# Altium schematic sheet top.SchDoc: top schematic
size 420 x 297 mm; Date: 2021-12-08; Author: Joachim Löfwander; Revision: AAA-000; SheetNumber: 1; SheetTotal: 4; Website: github.com/jlofw
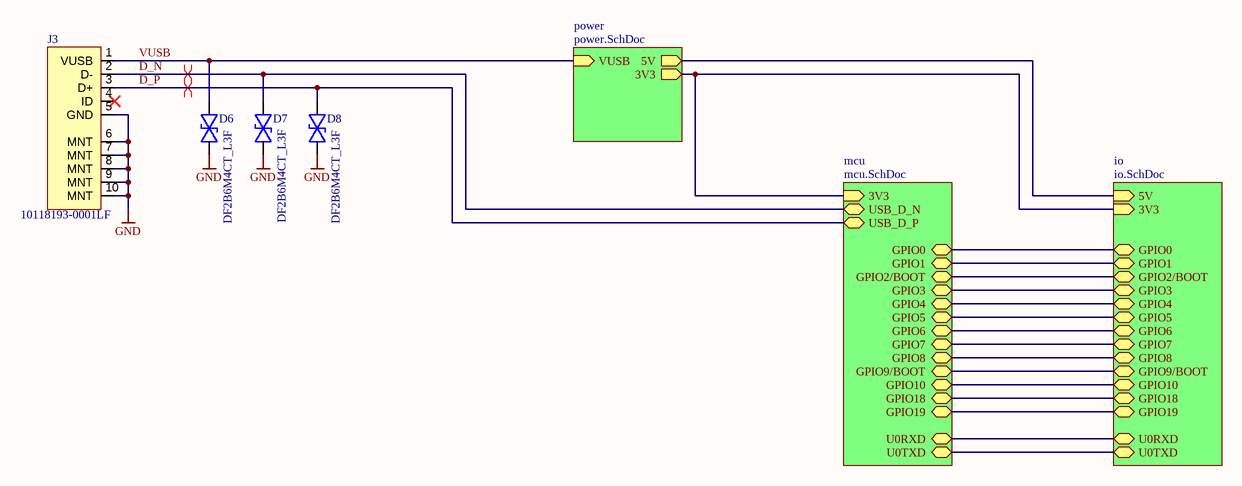
[diagram p0: top.SchDoc]

## Parts
D6  Manufacturer P/N: DF2B6M4CT_L3F  [D_SOD-882]  (hidden comment: diode_TVS_bi)
D7  Manufacturer P/N: DF2B6M4CT_L3F  [D_SOD-882]  (hidden comment: diode_TVS_bi)
D8  Manufacturer P/N: DF2B6M4CT_L3F  [D_SOD-882]  (hidden comment: diode_TVS_bi)
J3  Manufacturer P/N: 10118193-0001LF  [Amphenol_10118193-0001LF_Micro_USB]  (hidden comment: Amphenol_10118193-0001LF_Micro_USB)

## Sub-sheets
io = io.SchDoc: 5V (in), 3V3 (in), GPIO0 (bidir), GPIO1 (bidir), GPIO3 (bidir), GPIO4 (bidir), GPIO5 (bidir), GPIO6 (bidir), GPIO7 (bidir), GPIO10 (bidir), GPIO18 (bidir), GPIO19 (bidir), GPIO2/BOOT (bidir), GPIO8 (bidir), GPIO9/BOOT (bidir), U0RXD (bidir), U0TXD (bidir)
mcu = mcu.SchDoc: 3V3 (in), USB_D_P (bidir), USB_D_N (bidir), GPIO19 (bidir), GPIO0 (bidir), GPIO4 (bidir), GPIO3 (bidir), GPIO7 (bidir), GPIO18 (bidir), GPIO1 (bidir), GPIO5 (bidir), GPIO6 (bidir), GPIO10 (bidir), GPIO9/BOOT (bidir), GPIO2/BOOT (bidir), GPIO8 (bidir), U0TXD (bidir), U0RXD (bidir)
power = power.SchDoc: VUSB (in), 3V3 (out), 5V (out)

## Nets
GND: D6.2(A) D7.2(A) D8.2(A) J3.5(GND) J3.6(MNT) J3.7(MNT) J3.8(MNT) J3.9(MNT) J3.10(MNT)
D_N: D7.1(C) J3.2(D-) ; sheet mcu/USB_D_N
D_P: D8.1(C) J3.3(D+) ; sheet mcu/USB_D_P
VUSB: D6.1(C) J3.1(VUSB) ; sheet power/VUSB
(unnamed): sheet power/3V3, sheet mcu/3V3, sheet io/3V3
(unnamed): sheet power/5V, sheet io/5V
(unnamed): sheet mcu/GPIO19, sheet io/GPIO19
(unnamed): sheet mcu/GPIO0, sheet io/GPIO0
(unnamed): sheet mcu/GPIO4, sheet io/GPIO4
(unnamed): sheet mcu/GPIO3, sheet io/GPIO3
(unnamed): sheet mcu/GPIO7, sheet io/GPIO7
(unnamed): sheet mcu/GPIO18, sheet io/GPIO18
(unnamed): sheet mcu/GPIO1, sheet io/GPIO1
(unnamed): sheet mcu/GPIO5, sheet io/GPIO5
(unnamed): sheet mcu/GPIO6, sheet io/GPIO6
(unnamed): sheet mcu/GPIO10, sheet io/GPIO10
(unnamed): sheet mcu/GPIO9/BOOT, sheet io/GPIO9/BOOT
(unnamed): sheet mcu/GPIO2/BOOT, sheet io/GPIO2/BOOT
(unnamed): sheet mcu/GPIO8, sheet io/GPIO8
(unnamed): sheet mcu/U0TXD, sheet io/U0TXD
(unnamed): sheet mcu/U0RXD, sheet io/U0RXD

Not connected (* = marked no-connect by the designer): J3 4(ID)*

## Layout directives
differential pair: D_N, D_P

## Notes on the sheet
- PROJECT
- TITLE
- FILE NAME
- DATE MODIFIED
- SHEET
- REV
- OF
- AUTHOR
- WEBSITE

## Library data of the parts
D6-D8 = 40005: TVS DIODE 5.5VWM 15VC; Manufacturer: Toshiba; Internal Number: 40005; Package: SOD-882
J3 = 110003: Micro USB B SMD Horisontal; Manufacturer: Amphenol ICC / FCI; Internal Number: 110003